# Altium schematic sheet P7_FilterRoutingBypass.SchDoc
size 304 x 241 mm
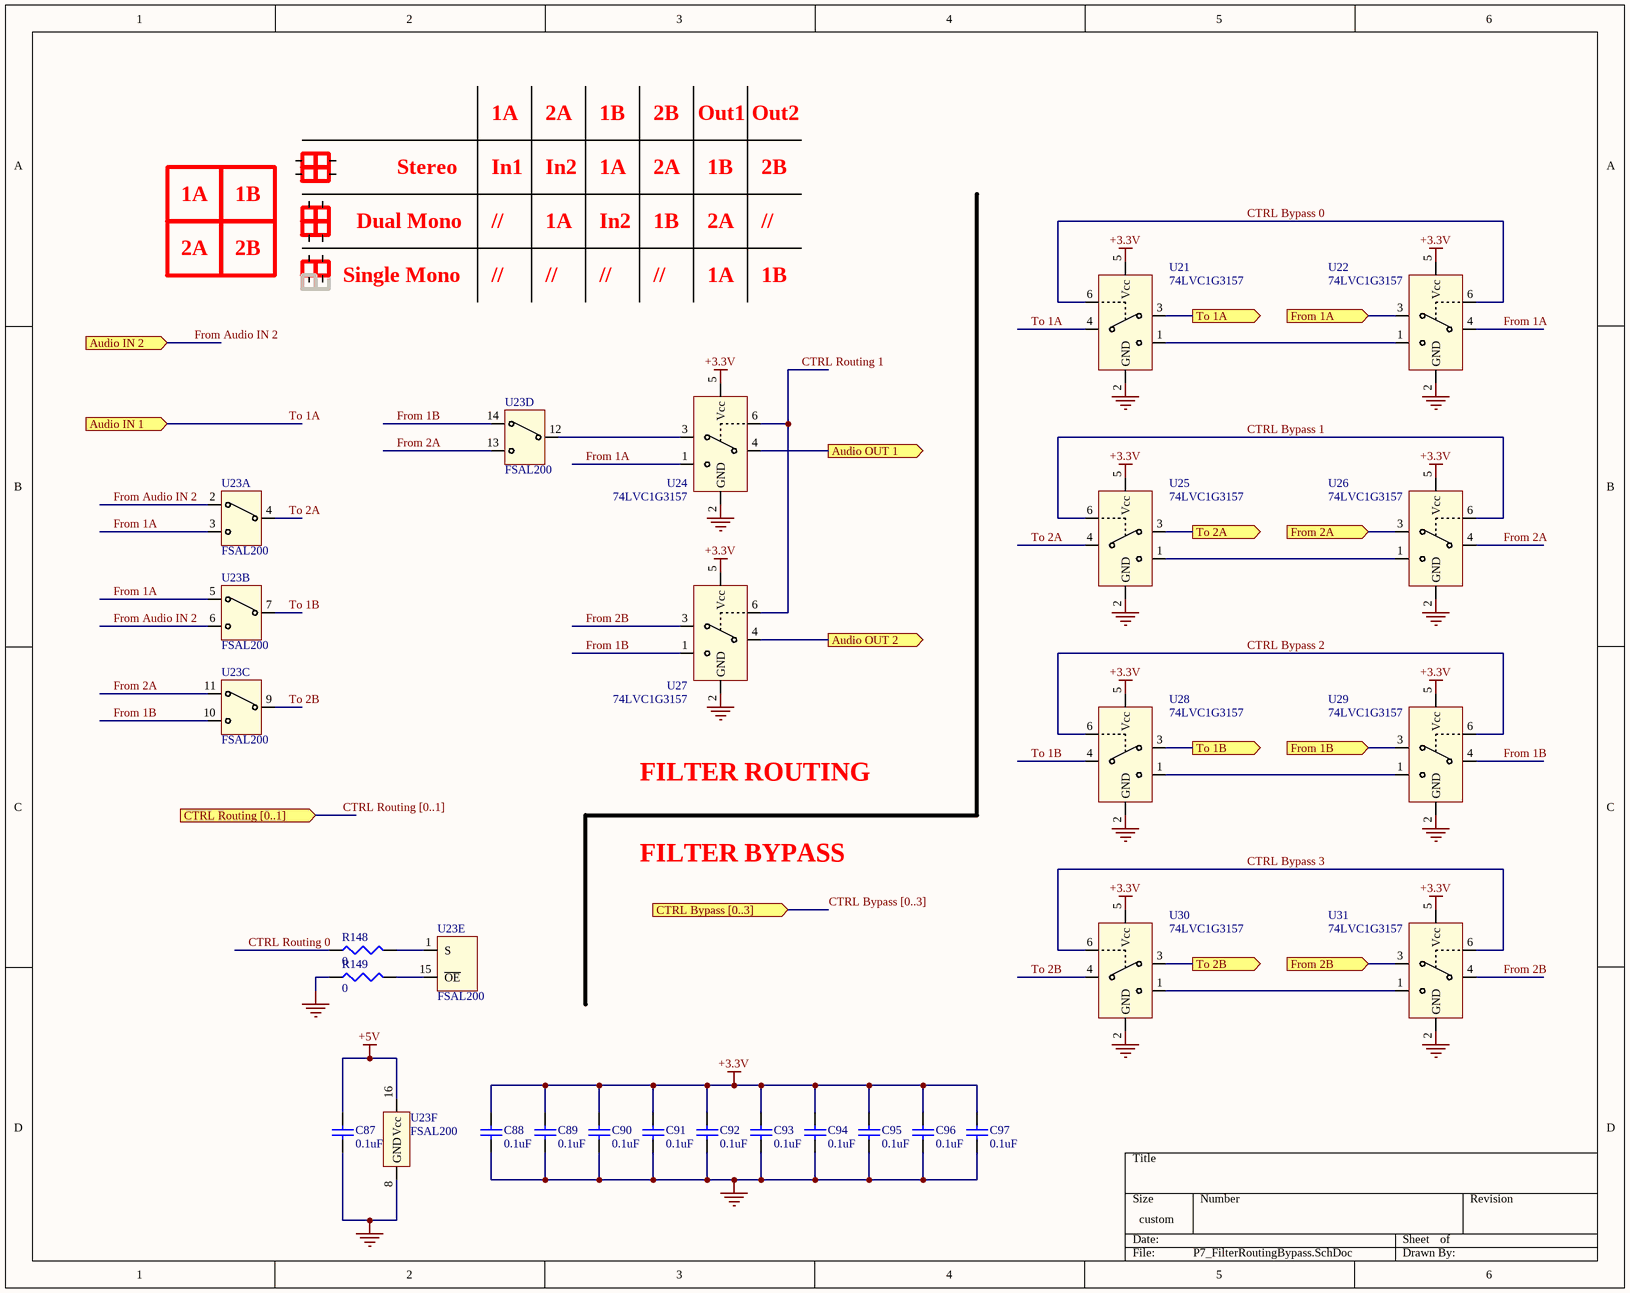
[diagram p0: P7_FilterRoutingBypass.SchDoc]

## Parts
C87  0.1uF  [CAP 0603 (1608 metric)]
C88  0.1uF  [CAP 0603 (1608 metric)]
C89  0.1uF  [CAP 0603 (1608 metric)]
C90  0.1uF  [CAP 0603 (1608 metric)]
C91  0.1uF  [CAP 0603 (1608 metric)]
C92  0.1uF  [CAP 0603 (1608 metric)]
C93  0.1uF  [CAP 0603 (1608 metric)]
C94  0.1uF  [CAP 0603 (1608 metric)]
C95  0.1uF  [CAP 0603 (1608 metric)]
C96  0.1uF  [CAP 0603 (1608 metric)]
C97  0.1uF  [CAP 0603 (1608 metric)]
R148  0  [RES 0603 (1608 metric)]
R149  0  [RES 0603 (1608 metric)]
U21  74LVC1G3157
U22  74LVC1G3157
U23  FSAL200  (parts A,B,C,D,E,F of 6)
U24  74LVC1G3157
U25  74LVC1G3157
U26  74LVC1G3157
U27  74LVC1G3157
U28  74LVC1G3157
U29  74LVC1G3157
U30  74LVC1G3157
U31  74LVC1G3157

## Ports
Audio IN 1 (in), Audio IN 2 (in), Audio OUT 1 (out), Audio OUT 2 (out), CTRL Bypass [0..3] (in), CTRL Routing [0..1] (in), From 1A (in), From 1B (in), From 2A (in), From 2B (in), To 1A (out), To 1B (out), To 2A (out), To 2B (out)

## Nets
+3.3V: C88.1 C89.1 C90.1 C91.1 C92.1 C93.1 C94.1 C95.1 C96.1 C97.1 U21.5(Vcc) U22.5(Vcc) U24.5(Vcc) U25.5(Vcc) U26.5(Vcc) U27.5(Vcc) U28.5(Vcc) U29.5(Vcc) U30.5(Vcc) U31.5(Vcc)
+5V: C87.1 U23.16(Vcc)
GND: C87.2 C88.2 C89.2 C90.2 C91.2 C92.2 C93.2 C94.2 C95.2 C96.2 C97.2 R149.1 U21.2(GND) U22.2(GND) U23.8(GND) U24.2(GND) U25.2(GND) U26.2(GND) U27.2(GND) U28.2(GND) U29.2(GND) U30.2(GND) U31.2(GND)
Audio OUT 1: U24.4(A) ; port Audio OUT 1
Audio OUT 2: U27.4(A) ; port Audio OUT 2
CTRL Bypass 0: U21.6(S) U22.6(S)
CTRL Bypass 1: U25.6(S) U26.6(S)
CTRL Bypass 2: U28.6(S) U29.6(S)
CTRL Bypass 3: U30.6(S) U31.6(S)
CTRL Routing 0: R148.1
CTRL Routing 1: U24.6(S) U27.6(S)
From 1A: U22.3(B1) ; port From 1A
From 1A: U22.4(A) U23.3(B2) U23.5(B1) U24.1(B2)  [a separate net that carries the same name]
From 1B: U29.3(B1) ; port From 1B
From 1B: U23.10(B2) U23.14(B1) U27.1(B2) U29.4(A)  [a separate net that carries the same name]
From 2A: U26.3(B1) ; port From 2A
From 2A: U23.11(B1) U23.13(B2) U26.4(A)  [a separate net that carries the same name]
From 2B: U31.3(B1) ; port From 2B
From 2B: U27.3(B1) U31.4(A)  [a separate net that carries the same name]
From Audio IN 2: U23.2(B1) U23.6(B2) ; port Audio IN 2
To 1A: U21.3(B1) ; port To 1A
To 1A: U21.4(A) ; port Audio IN 1  [a separate net that carries the same name]
To 1B: U28.3(B1) ; port To 1B
To 1B: U23.7(A) U28.4(A)  [a separate net that carries the same name]
To 2A: U25.3(B1) ; port To 2A
To 2A: U23.4(A) U25.4(A)  [a separate net that carries the same name]
To 2B: U30.3(B1) ; port To 2B
To 2B: U23.9(A) U30.4(A)  [a separate net that carries the same name]
NetR148_2: R148.2 U23.1(S)
NetR149_2: R149.2 U23.15(~{OE})
NetU21_1: U21.1(B2) U22.1(B2)
NetU23_12: U23.12(A) U24.3(B1)
NetU25_1: U25.1(B2) U26.1(B2)
NetU28_1: U28.1(B2) U29.1(B2)
NetU30_1: U30.1(B2) U31.1(B2)

## Buses and harness runs
bus CTRL Bypass [0..3] = port CTRL Bypass [0..3]
bus CTRL Routing [0..1] = port CTRL Routing [0..1]

## Notes on the sheet
- 1A
- 2A
- 1B
- 2B
- Out1
- Out2
- Dual Mono
- Stereo
- In1
- //
- In2
- Single Mono
- FILTER ROUTING
- FILTER BYPASS

## Library data of the parts
C87-C97 = Cap Semi: Capacitor (Semiconductor SIM Model); Value: 0.1uF
R148 R149 = Res3: Resistor; Value: 0
U21 U22 U24-U31 = 74LVC1G3157: Single 2:1 Multiplexer
U23 = FSAL200: Quad 2:1 Multiplexer